# EAGLE design Projet-Elec-Groupe4 (EAGLE 8.0.2)
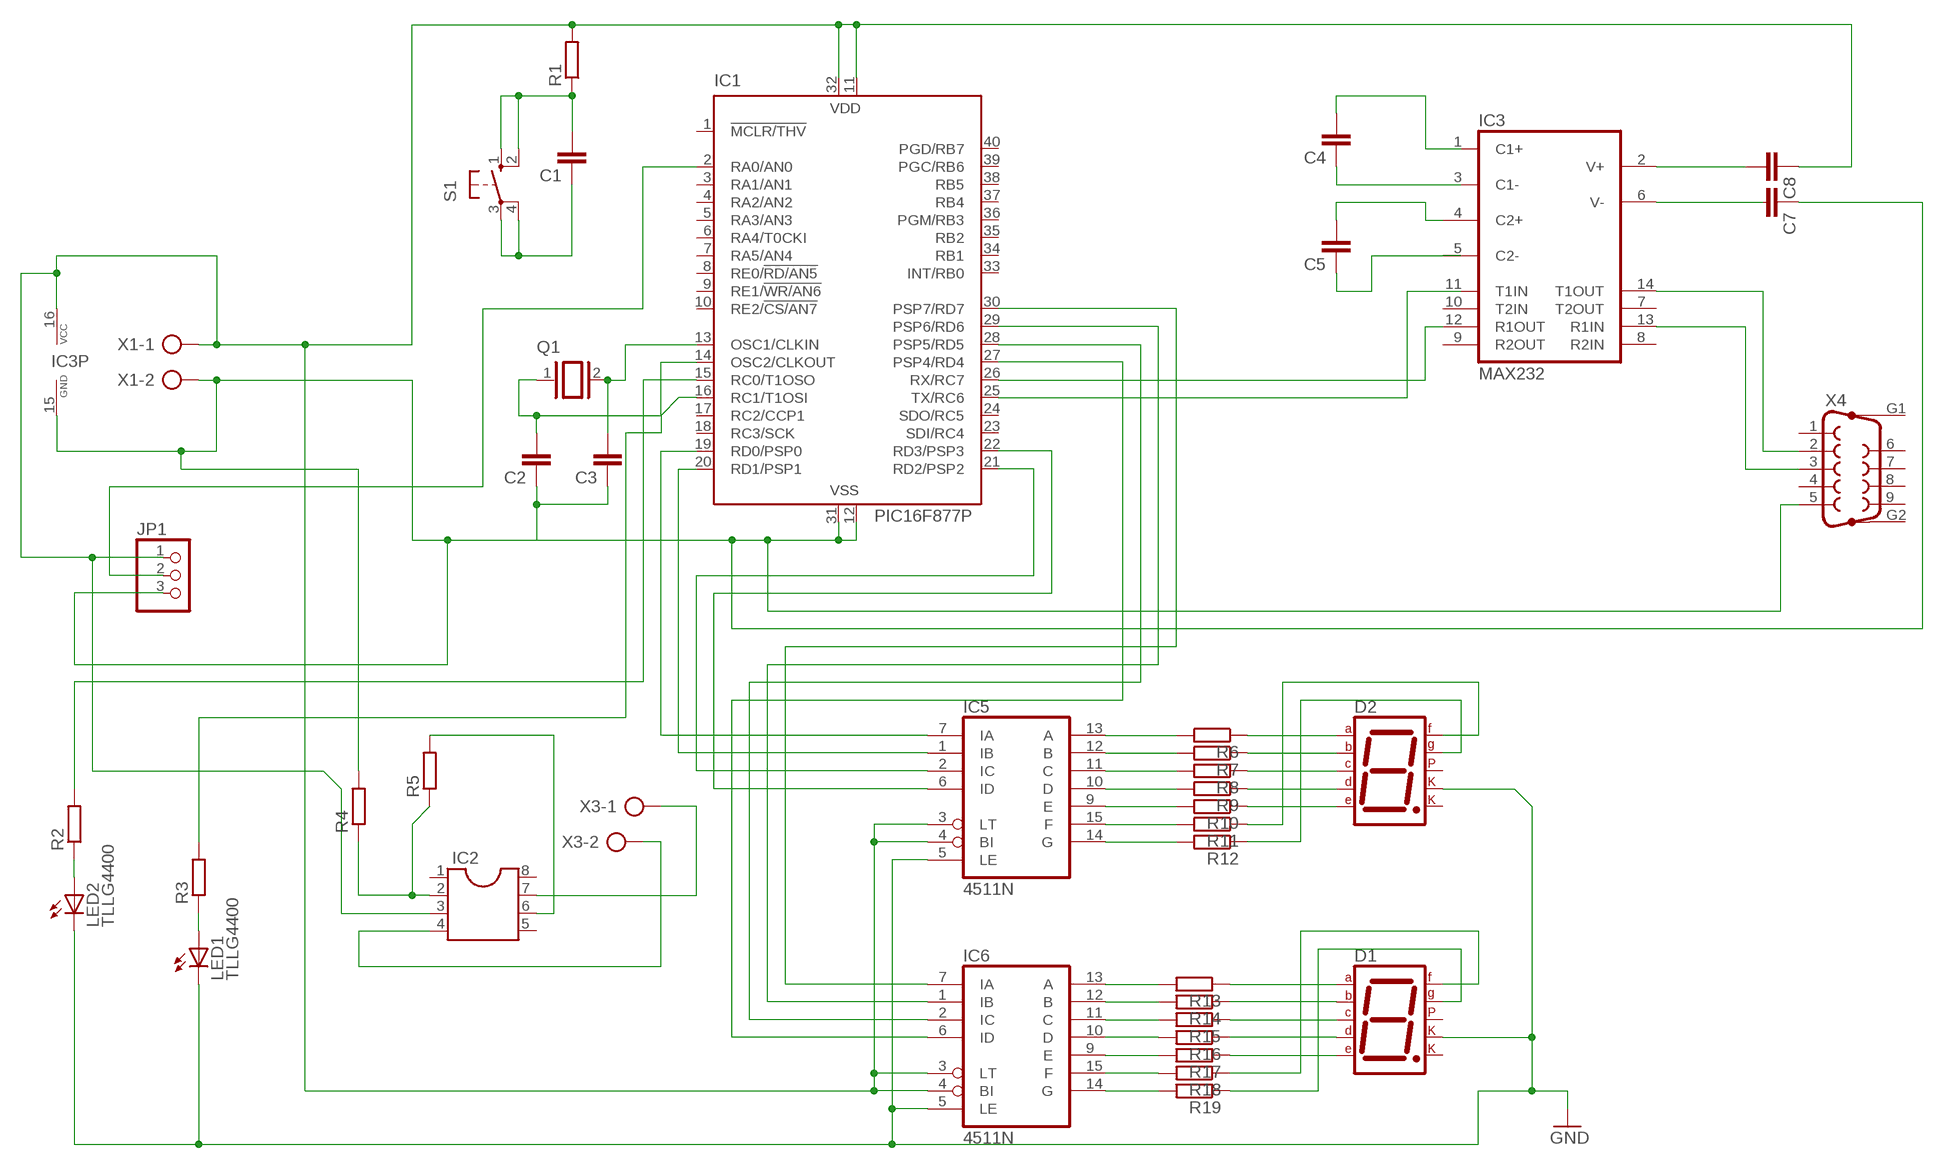
[diagram p0: schematic, sheet 1]

## Parts
C1  C-EU025-025X050  [C025-025X050]
C2  C-EU025-024X044  [C025-024X044]
C3  C-EU025-024X044  [C025-024X044]
C4  C-EU025-024X044  [C025-024X044]
C5  C-EU025-024X044  [C025-024X044]
C7  C-EU025-024X044  [C025-024X044]
C8  C-EU025-024X044  [C025-024X044]
D1  7SEG-CK  [7SEG-13]
D2  7SEG-CK  [7SEG-13]
IC1  PIC16F877P  [DIL40]
IC2  DIL8  [DIL08]
IC3  MAX232  [DIL16]
IC5  4511N  [DIL16]
IC6  4511N  [DIL16]
JP1  PINHD-1X3  [1X03]
LED1  TLLG4400  [LED3MM]
LED2  TLLG4400  [LED3MM]
Q1  XTAL/S  [QS]
R1  R-EU_0207/10  [0207/10]
R2  R-EU_0207/10  [0207/10]
R3  R-EU_0207/10  [0207/10]
R4  R-EU_0207/10  [0207/10]
R5  R-EU_0207/10  [0207/10]
R6  R-EU_0207/10  [0207/10]
R7  R-EU_0207/10  [0207/10]
R8  R-EU_0207/10  [0207/10]
R9  R-EU_0207/10  [0207/10]
R10  R-EU_0207/10  [0207/10]
R11  R-EU_0207/10  [0207/10]
R12  R-EU_0207/10  [0207/10]
R13  R-EU_0207/10  [0207/10]
R14  R-EU_0207/10  [0207/10]
R15  R-EU_0207/10  [0207/10]
R16  R-EU_0207/10  [0207/10]
R17  R-EU_0207/10  [0207/10]
R18  R-EU_0207/10  [0207/10]
R19  R-EU_0207/10  [0207/10]
S1  10-XX  [B3F-10XX]
X1  AK300/2  [AK300/2]
X3  AK300/2  [AK300/2]
X4  F09HP  [F09HP]

## Nets
GND: D1.3(CK1) D2.3(CK1) IC5.5(LE) IC6.5(LE) LED1.K(C) LED2.K(C)
N$1: C5.2 IC3.4(C2+)
N$2: C2.2 IC1.14(OSC2/CLKOUT) Q1.1
N$3: C8.1 IC1.11(VDD) IC1.32(VDD) IC2.3 IC3.16(VCC) IC5.3(LT) IC5.4(BI) IC6.3(LT) IC6.4(BI) JP1.1 R1.2 X1.1
N$4: C1.2 R1.1 S1.1(S) S1.2(S1)
N$5: C1.1 S1.3(P) S1.4(P1)
N$6: C5.1 IC3.5(C2-)
N$7: C3.2 IC1.13(OSC1/CLKIN) Q1.2
N$9: IC1.25(TX/RC6)
N$10: IC1.2(RA0/AN0) JP1.2
N$11: IC1.26(RX/RC7) IC3.12(R1OUT)
N$12: IC3.14(T1OUT) X4.2
N$13: IC3.13(R1IN) X4.3
N$14: C4.1 IC3.3(C1-)
N$15: C4.2
N$16: IC3.6(V-)
N$17: C8.2 IC3.2(V+)
N$18: IC5.13(A) R6.2
N$19: D2.7(A) R6.1
N$20: IC5.12(B) R7.2
N$21: D2.6(B) R7.1
N$22: IC5.11(C) R8.2
N$23: D2.9(F) R11.1
N$24: D2.10(G) R12.1
N$25: IC2.7 X3.1
N$26: IC1.19(RD0/PSP0) IC5.7(IA)
N$27: IC1.20(RD1/PSP1) IC5.1(IB)
N$28: IC1.21(RD2/PSP2) IC5.2(IC)
N$29: IC1.22(RD3/PSP3) IC5.6(ID)
N$30: IC6.13(A) R13.2
N$31: D1.7(A) R13.1
N$32: D1.6(B) R14.1
N$33: IC6.12(B) R14.2
N$34: IC6.11(C) R15.2
N$35: IC1.27(PSP4/RD4) IC6.6(ID)
N$36: IC1.28(PSP5/RD5) IC6.2(IC)
N$37: IC1.29(PSP6/RD6) IC6.1(IB)
N$38: IC1.30(PSP7/RD7) IC6.7(IA)
N$39: IC1.15(RC0/T1OSO) R2.2
N$40: LED2.A R2.1
N$41: IC2.4 X3.2
N$42: IC2.2 R4.1 R5.1
N$44: LED1.A R3.1
N$45: IC2.6 R5.2
N$46: D2.4(C) R8.1
N$47: D1.9(F) R18.1
N$48: D1.10(G) R19.1
N$49: IC5.10(D) R9.2
N$50: D2.2(D) R9.1
N$51: IC5.9(E) R10.2
N$52: D2.1(E) R10.1
N$53: IC5.15(F) R11.2
N$54: IC5.14(G) R12.2
N$55: IC6.10(D) R16.2
N$56: IC6.9(E) R17.2
N$57: IC6.15(F) R18.2
N$58: IC6.14(G) R19.2
N$59: D1.4(C) R15.1
N$60: D1.2(D) R16.1
N$61: D1.1(E) R17.1
N$63: IC1.16(RC1/T1OSI) R3.2
N$65: C2.1 C3.1 C7.1 IC1.12(VSS) IC1.31(VSS) IC3.15(GND) JP1.3 R4.2 X1.2 X4.5
Unconnected: C7.2 D1.5(DP) D1.8(CK2) D2.5(DP) D2.8(CK2) IC1.1(!MCLR/THV) IC1.3(RA1/AN1) IC1.4(RA2/AN2) IC1.5(RA3/AN3) IC1.6(RA4/T0CKI) IC1.7(RA5/AN4) IC1.8(RE0/!RD/AN5) IC1.9(RE1/!WR/AN6) IC1.10(RE2/!CS/AN7) IC1.17(RC2/CCP1) IC1.18(RC3/SCK) IC1.23(SDI/RC4) IC1.24(SDO/RC5) IC1.33(INT/RB0) IC1.34(RB1) IC1.35(RB2) IC1.36(PGM/RB3) IC1.37(RB4) IC1.38(RB5) IC1.39(PGC/RB6) IC1.40(PGD/RB7) IC2.1 IC2.5 IC2.8 IC3.1(C1+) IC3.7(T2OUT) IC3.8(R2IN) IC3.9(R2OUT) IC3.10(T2IN) IC3.11(T1IN) X4.1 X4.4 X4.6 X4.7 X4.8 X4.9 X4.G1 X4.G2

## Power pins joined to a net without a drawn wire
VDD: IC5.16(VDD) IC6.16(VDD)
VSS: IC5.8(VSS) IC6.8(VSS)

## Library data of the parts
C1-C5 C7 C8 = rcl:C-EU: CAPACITOR, European symbol
D1 D2 = special:7SEG-CK: 7-segment DISPLAY single cathode, 13 mm
IC1 = microchip:PIC16F87*: MICROCONTROLLER; MF: MICROCHIP; MPN: PIC16F877-04/P; OC_FARNELL: 9761349; OC_NEWARK: 61K3463
IC2 = ic-package:DIL8: Dual In Line / Socket
IC3 = maxim:MAX232: RS232 TRANSCEIVER; MF: MAXIM; MPN: MAX232ACPE+; OC_FARNELL: 9723773; OC_NEWARK: 68K4544
IC5 IC6 = 45xx:4511: BCD to 7-segment LATCH/DECODER/DRIVER
JP1 = pinhead:PINHD-1X3: PIN HEADER
LED1 LED2 = led:TLLG4400: Low Current (2mA) LED 3 mm Tinted Diffused Package color GREEN Source: Data sheet <http://www.farnell.com/datasheets/391098.pdf>; MF: VISHAY SEMICONDUCTOR; OC_FARNELL: 1612435
Q1 = special:XTAL/S: CRYSTAL
R1-R19 = rcl:R-EU_: RESISTOR, European symbol
S1 = switch-omron:10-XX: OMRON SWITCH; MPN: B3F-1000; OC_FARNELL: 176432; OC_NEWARK: 36M3542
X1 X3 = con-ptr500:AK300/2: CONNECTOR; OC_FARNELL: unknown; OC_NEWARK: unknown
X4 = con-subd:F09HP: SUB-D; OC_FARNELL: unknown; OC_NEWARK: unknown

## Board
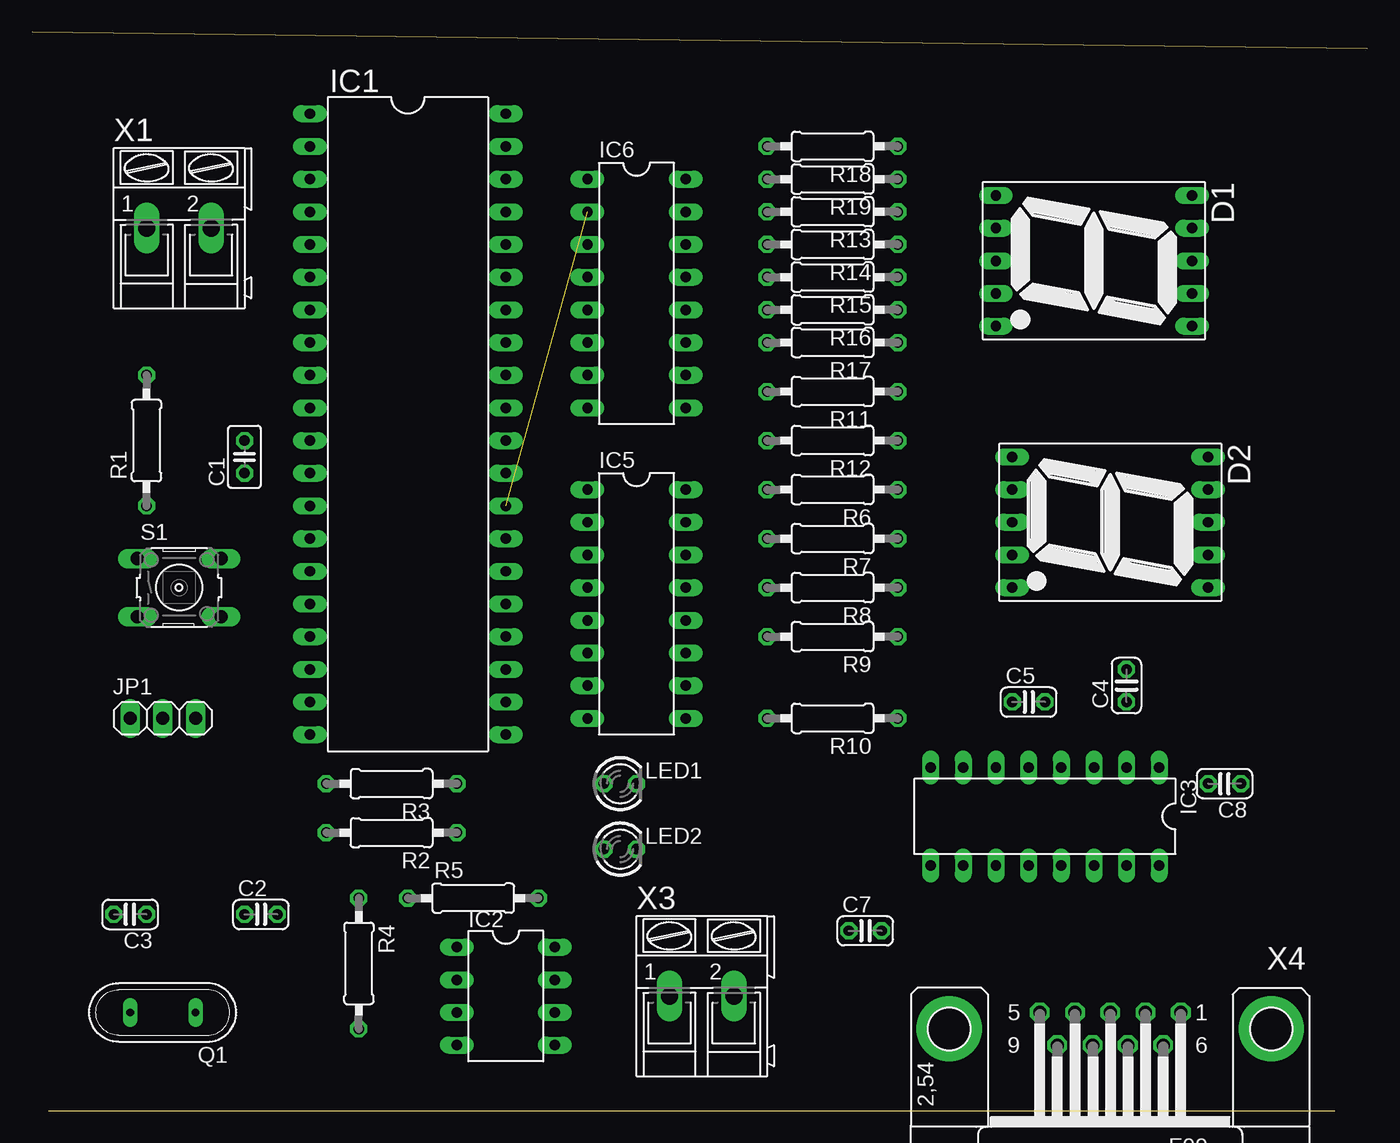
[diagram p1: board, top side]
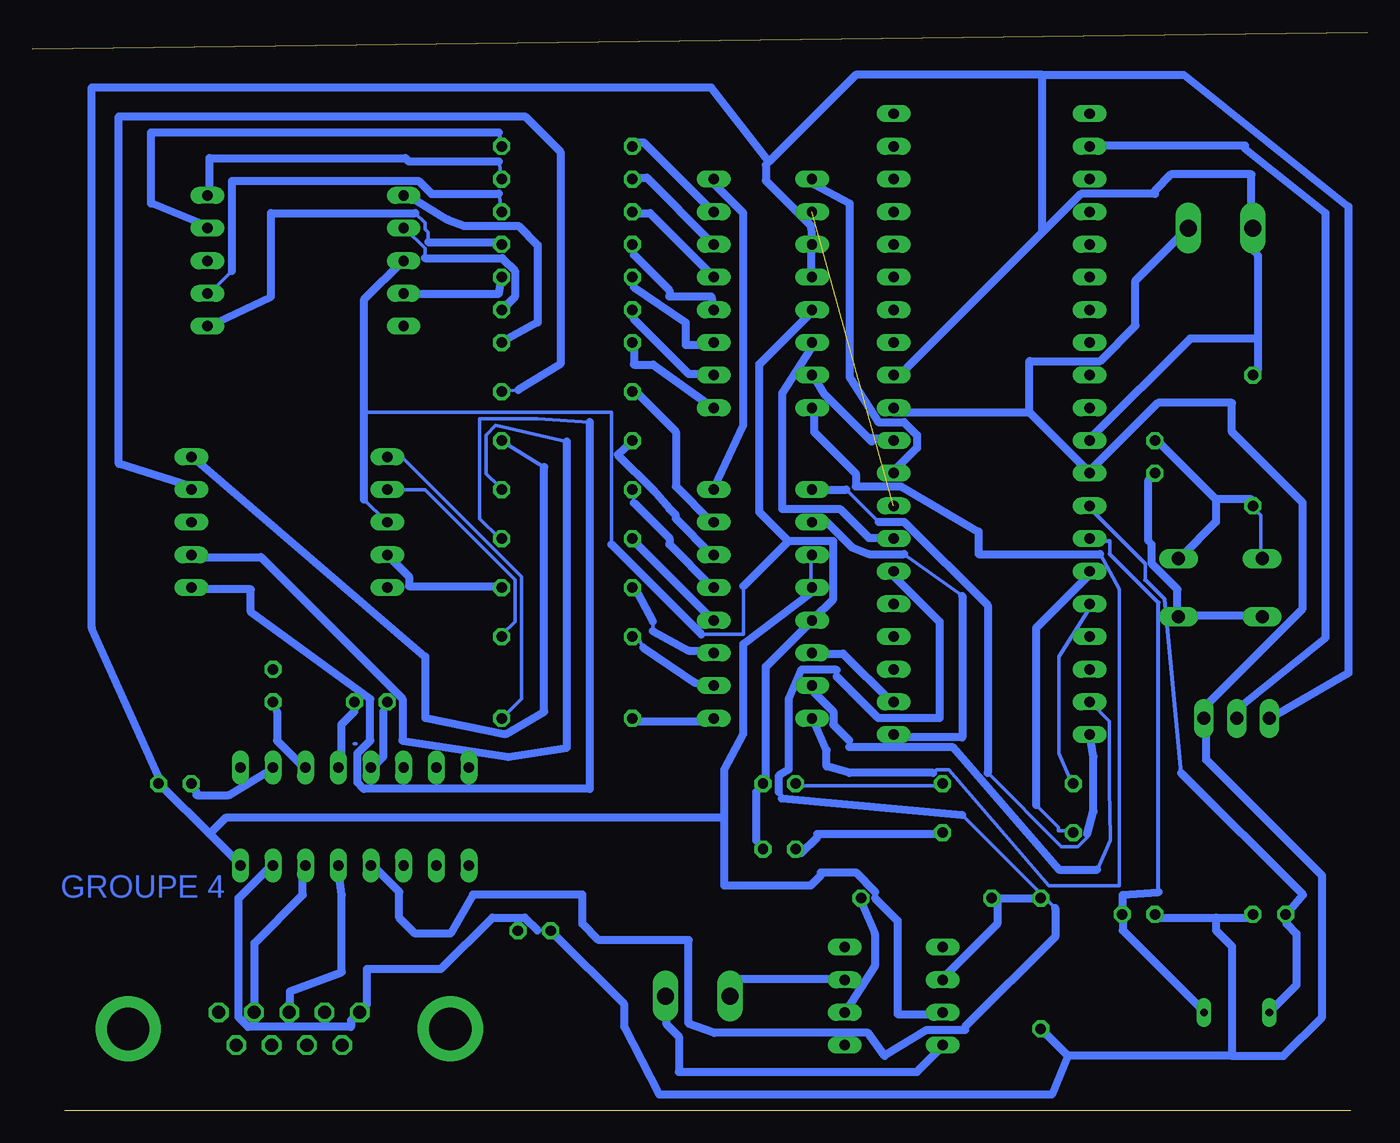
[diagram p2: board, bottom side, seen from below]

Size 103.81 x 83.81 mm. Coordinates in mm from the lower left corner, seen from the top.
Outline: 1.27,0 101.27,0
Outline: 103.81,82.54 0,83.81
Copper layers (1*16): Top 0.035mm / dielectric 1.5mm / Bottom 0.035mm
Design rules "default": minimum track width 10mil, minimum drill 24mil, track to track 8mil, track to pad 8mil, pad to pad 8mil, via to via 8mil, smd to smd 8mil, copper to edge 40mil, drill to drill 8mil, minimum pad ring 10mil, minimum via ring 8mil, stop-mask expansion 4mil, vias tented up to drill 0mil, thermal gap 10mil

### Footprints (pad centres in the part's own frame; a part is rotated, then mirrored left to right if it is on the bottom)
C025-025X050 = drill 0.813 octagon: 1 -1.27,0; 2 1.27,0
C025-024X044 = drill 0.813 octagon: 1 -1.27,0; 2 1.27,0
7SEG-13 = drill 0.813 long: 1 -5.08,-7.62; 2 -2.54,-7.62; 3 0,-7.62; 4 2.54,-7.62; 5 5.08,-7.62; 6 5.08,7.62; 7 2.54,7.62; 8 0,7.62; 9 -2.54,7.62; 10 -5.08,7.62
DIL40 = drill 0.813 long: 1 -24.13,-7.62; 2 -21.59,-7.62; 3 -19.05,-7.62; 4 -16.51,-7.62; 5 -13.97,-7.62; 6 -11.43,-7.62; 7 -8.89,-7.62; 8 -6.35,-7.62; 9 -3.81,-7.62; 10 -1.27,-7.62; 11 1.27,-7.62; 12 3.81,-7.62; 13 6.35,-7.62; 14 8.89,-7.62; 15 11.43,-7.62; 16 13.97,-7.62; 17 16.51,-7.62; 18 19.05,-7.62; 19 21.59,-7.62; 20 24.13,-7.62; 21 24.13,7.62; 22 21.59,7.62; 23 19.05,7.62; 24 16.51,7.62; 25 13.97,7.62; 26 11.43,7.62; 27 8.89,7.62; 28 6.35,7.62; 29 3.81,7.62; 30 1.27,7.62; 31 -1.27,7.62; 32 -3.81,7.62; 33 -6.35,7.62; 34 -8.89,7.62; 35 -11.43,7.62; 36 -13.97,7.62; 37 -16.51,7.62; 38 -19.05,7.62; 39 -21.59,7.62; 40 -24.13,7.62
DIL08 = drill 0.813 long: 1 -3.81,-3.81; 2 -1.27,-3.81; 3 1.27,-3.81; 4 3.81,-3.81; 5 3.81,3.81; 6 1.27,3.81; 7 -1.27,3.81; 8 -3.81,3.81
DIL16 = drill 0.813 long: 1 -8.89,-3.81; 2 -6.35,-3.81; 3 -3.81,-3.81; 4 -1.27,-3.81; 5 1.27,-3.81; 6 3.81,-3.81; 7 6.35,-3.81; 8 8.89,-3.81; 9 8.89,3.81; 10 6.35,3.81; 11 3.81,3.81; 12 1.27,3.81; 13 -1.27,3.81; 14 -3.81,3.81; 15 -6.35,3.81; 16 -8.89,3.81
1X03 = drill 1.016 long: 1 -2.54,0; 2 0,0; 3 2.54,0
LED3MM = drill 0.813 octagon: A -1.27,0; K 1.27,0
QS = drill 0.61 long: 1 -2.54,0; 2 2.54,0
0207/10 = drill 0.813 octagon: 1 -5.08,0; 2 5.08,0
B3F-10XX = drill 1.016 long: 1 -3.251,2.261; 2 3.251,2.261; 3 -3.251,-2.261; 4 3.251,-2.261
AK300/2 = drill 1.321 long: 1 -2.515,0; 2 2.489,0
F09HP = drill 1.016 octagon: 1 -5.486,-1.27; 2 -2.743,-1.27; 3 0,-1.27; 4 2.743,-1.27; 5 5.486,-1.27; 6 -4.115,1.27; 7 -1.372,1.27; 8 1.372,1.27; 9 4.115,1.27 | drill 3.302 pad 5.08: G1 -12.522,0; G2 12.522,0

### Placement (x,y rotation side)
C1  16.51,50.8 90 top
C2  17.78,15.24 0 top
C3  7.62,15.24 180 top
C4  85.09,33.02 90 top
C5  77.47,31.75 0 top
C7  64.77,13.97 0 top
C8  92.71,25.4 180 top
D1  82.55,66.04 270 top
D2  83.82,45.72 270 top
IC1  29.21,53.34 270 top
IC2  36.83,8.89 270 top
IC3  78.74,22.86 180 top
IC5  46.99,39.37 270 top
IC6  46.99,63.5 270 top
JP1  10.16,30.48 0 top
LED1  45.72,25.4 0 top
LED2  45.72,20.32 0 top
Q1  10.16,7.62 180 top
R1  8.89,52.07 90 top
R2  27.94,21.59 180 top
R3  27.94,25.4 180 top
R4  25.4,11.43 270 top
R5  34.29,16.51 0 top
R6  62.23,48.26 180 top
R7  62.23,44.45 180 top
R8  62.23,40.64 180 top
R9  62.23,36.83 180 top
R10  62.23,30.48 180 top
R11  62.23,55.88 180 top
R12  62.23,52.07 180 top
R13  62.23,69.85 180 top
R14  62.23,67.31 180 top
R15  62.23,64.77 180 top
R16  62.23,62.23 180 top
R17  62.23,59.69 180 top
R18  62.23,74.93 180 top
R19  62.23,72.39 180 top
S1  11.43,40.64 0 top
X1  11.43,68.58 0 top
X3  52.07,8.89 0 top
X4  83.82,6.35 180 top

### Tracks (layer width: path | path; a pad name or v marks a point on that pad's centre or on a via)
GND
  Bottom 0.254: 47.52,21 47.02,20.5 LED2.K | 47.52,24.75 47.02,25.25 LED1.K 46.77,25.5 | 43.27,38 IC5.5 43.02,38.25 | 78.02,47.5 76.27,45.75 D2.3 | 75.02,66 D1.3 | 43.27,62 IC6.5 | 78.02,54.25 58.77,54.25 58.77,44 | 51.77,37 48.52,37 48.52,40.75
  Bottom 0.61: 47.52,24.75 47.52,21 | 43.27,38 46.77,34.5 46.77,25.5 | 78.02,47.5 78.02,54.25 78.02,63 75.02,66 | 43.27,62 47.27,58 47.27,46.5 45.02,44.25 | 45.02,44.25 41.52,44.25 41.52,39.75 43.02,38.25 | 51.77,37 58.77,44 | 45.02,44.25 48.52,40.75
N$1
  Bottom 0.254: 78.77,31 78.77,31.75 C5.2 | 79.77,26.75 IC3.4
  Bottom 0.61: 79.77,26.75 79.77,30 78.77,31
N$2
  Bottom 0.254: 12.77,7.75 Q1.1 | 19.02,15 C2.2 19.02,15.25 | 20.02,43.25 20.02,44.25 | 21.52,44.25 IC1.14
  Bottom 0.305: 20.02,44.25 21.52,44.25 | 20.02,43.25 16.25,39.48 16.25,16.98
  Bottom 0.61: 12.77,7.75 19.02,14 19.02,15 | 16.25,16.98 19.02,16.75 19.02,15.25
N$3
  Bottom 0.254: 43.27,65 IC6.4 | 43.27,67.25 IC6.3 | 8.52,57.5 8.77,57.25 R1.2 | 8.77,66.75 8.52,66.5 | 8.77,68.5 X1.1 9.02,68.75 | 21.52,52.25 IC1.11 | 35.77,57.75 35.77,57.25 36.77,57.25 IC1.32 | 16.52,71.5 16.52,71.25 | 7.52,30.5 JP1.1 | 46.52,73.75 46.77,73.5 | 87.77,19.25 IC3.16 | 93.77,25.25 C8.1 94.02,25.5 94.02,26 | 38.27,17 38.27,16.5 | 42.52,18.25 42.52,18.5 | 43.27,40.25 43.27,40.5 IC5.4 43.27,40.75 43.27,43 IC5.3 | 33.02,7.5 IC2.3
  Bottom 0.61: 43.27,67.25 43.27,65 | 8.52,66.5 8.52,60 | 8.52,60 8.52,57.5 | 8.77,68.5 8.77,66.75 | 21.52,52.25 13.77,60 8.52,60 | 25.27,68.25 22.27,71.25 16.52,71.25 | 25.27,68.25 35.77,57.75 | 16.52,71.5 15.27,72.75 9.02,72.75 9.02,68.75 | 7.52,30.5 1.48,34 1.48,70.25 14.27,80.5 25.27,80.5 | 25.27,68.25 25.27,80.5 | 46.77,73.5 46.77,72.27 43.27,68.77 IC6.3 | 25.27,80.5 39.77,80.5 46.52,73.75 51.02,79.52 99.17,79.52 99.17,37.5 94.02,26 | 93.77,25.25 90.02,21.5 | 90.02,21.5 87.77,19.25 | 33.02,7.5 36.52,7.5 36.52,14.75 38.27,16.5 | 38.27,17 39.77,18.5 42.52,18.5 | 42.52,18.25 43.27,17.5 50.02,17.5 50.02,22.75 | 50.02,22.75 50.02,26.5 48.54,29.25 48.54,36.25 43.27,40.25 | 90.02,21.5 88.77,22.75 50.02,22.75
N$4
  Bottom 0.254: S1.1 8.27,43 8.27,46.25 8.77,46.75 R1.1 9.02,47 9.02,47.5 | 16.27,52 C1.2 | 14.52,43 S1.2
  Bottom 0.61: 11.77,47.5 16.27,52 | 9.02,47.5 11.77,47.5 | 14.52,43 11.77,45.75 11.77,47.5
N$5
  Bottom 0.254: 17.02,49 16.52,49.5 C1.1 | 16.77,44 17.02,44.25 | 14.77,38.5 S1.4 14.52,38.5 | 8.27,38.5 S1.3
  Bottom 0.61: 17.02,44.25 17.02,49 | 16.77,44 16.77,42.5 14.77,40.5 14.77,38.5 | 14.52,38.5 8.27,38.5
N$6
  Bottom 0.254: 76.52,31 76.27,31.25 76.27,31.75 C5.1 | 77.27,26.75 IC3.5
  Bottom 0.61: 77.27,26.75 76.52,27.5 76.52,31
N$7
  Bottom 0.254: 7.52,7.75 Q1.2 | 6.27,15 C3.2 6.27,15.25 | 17.27,41.25 17.27,42.5 | 21.52,46.75 IC1.13
  Bottom 0.305: 17.27,42.5 21.52,46.75 | 17.27,41.25 15.75,39.73 14.48,26.23
  Bottom 0.61: 7.52,7.75 5.52,9.75 5.52,13.75 6.27,14.5 6.27,15 | 14.48,26.23 5,16.75 6.27,15.25
N$8
  Bottom 0.254: 78.77,28.5 78.64,28.51
  pour Bottom (isolate 0.8): 0,83.82 0,0 104.14,0 104.14,82.55
N$10
  Bottom 0.254: 9.52,74.75 9.52,75 | 10.02,31.25 10.02,30.5 JP1.2 | 21.52,75 IC1.2
  Bottom 0.61: 9.52,75 21.52,75 | 9.52,74.75 3.25,69.75 3.25,36.75 10.02,31.25
N$11
  Bottom 0.254: 31.27,6.5 31.27,6.25 | 31.52,22.98 24.27,15.73 | 45.52,24.25 45.52,24.5 45.77,24.75 | 41.27,33.75 41.27,34.25 | 36.77,41.5 36.77,41.75 IC1.26 | 77.27,19 IC3.12
  Bottom 0.61: 77.27,19 75.27,17 75.27,15 74.02,13.75 71.29,13.75 69.54,16.77 61.02,16.77 61.02,14.5 59.77,13.25 52.77,13.25 52.77,6.75 50.79,6.04 38.81,6.04 37.54,4.25 34.27,6.25 31.27,6.25 | 31.27,6.5 24.27,13.5 24.27,15.73 | 45.52,24.25 31.52,22.98 | 45.77,24.75 45.77,26 45,26.5 45,32 44.02,34.25 41.27,34.25 | 41.27,33.75 38.02,30.5 33.27,30.5 33.27,38 36.77,41.5
N$12
  Bottom 0.254: 82.77,19 IC3.14 | 86.52,7.75 X4.2
  Bottom 0.61: 82.77,19 82.77,16.75 86.52,13 86.52,7.75
N$13
  Bottom 0.254: 80.02,19 IC3.13 | 83.77,7.75 X4.3
  Bottom 0.61: 80.02,19 79.73,16.75 79.73,10.75 83.77,9.25 83.77,7.75
N$14
  Bottom 0.254: 84.77,31 85.02,31.25 85.02,31.75 C4.1 | 82.77,26.75 IC3.3
  Bottom 0.61: 82.77,26.75 84.77,28.75 84.77,31
N$17
  Bottom 0.254: 91.02,24.75 91.02,24.52 | 91.27,25 91.27,25.25 C8.2 | 85.27,26.5 IC3.2
  Bottom 0.61: 85.27,26.5 88.52,24.52 91.02,24.52 | 91.27,25 91.02,24.75
N$18
  Bottom 0.254: 51.02,40.75 IC5.13 | 57.02,47.23 R6.2
  Bottom 0.61: 51.02,40.75 54.27,44 54.27,44.48 57.02,47.23
N$19
  Bottom 0.254: 62.23,51.98 67.77,53.25 68.52,52.5 68.52,49.5 67.52,48.5 R6.1 | 91.27,43 D2.7
  Bottom 0.61: 62.23,51.98 62.23,28.21 66.77,27.48 75.02,28.75 75.02,32 86.02,43 91.27,43
N$20
  Bottom 0.254: 51.02,38.25 IC5.12 | 57.02,44.25 R7.2
  Bottom 0.61: 57.02,44.25 51.02,38.25
N$21
  Bottom 0.254: 60.46,53.5 64.52,53.75 69.02,53.75 69.02,46 67.52,44.5 R7.1 | 91.27,40.5 D2.6
  Bottom 0.61: 91.27,40.5 86.81,40.5 86.81,38.75 77.52,32 77.52,28.75 78.52,27.75 78.52,25.5 78.02,25 60.46,25 60.46,53.5
N$22
  Bottom 0.254: 55.54,38 55.54,37.25 | 51.02,35.75 IC5.11 | 57.02,40.75 R8.2
  Bottom 0.61: 51.02,35.75 52.77,35.75 55.54,37.25 | 57.02,40.75 55.54,38
N$23
  Bottom 0.254: 66,56 R11.1 | 91.52,48.5 D2.9
  Bottom 0.61: 66,56 62.73,58 62.73,74.5 65.5,77.27 97.08,77.27 97.08,50.25 91.52,48.5
N$24
  Bottom 0.254: 64,50 67.27,52 R12.1 | 91.27,50.75 D2.10
  Bottom 0.61: 64,50 64,31 67.02,29.25 73.25,30.52 73.25,35.27 91.27,50.75
N$25
  Bottom 0.254: 40.77,10.25 IC2.7 | 49.52,9 X3.1
  Bottom 0.61: 40.77,10.25 49.52,10.25 49.52,9
N$26
  Bottom 0.254: 21,18.73 20,21 20,21.25 20.04,25.02 20.04,30.27 21.52,31.75 IC1.19 | 40.27,28.75 40.27,28.27 | 43.02,32.5 43.02,33 IC5.7
  Bottom 0.61: 21,18.73 24,18.73 32.27,28.27 40.27,28.27 | 40.27,28.75 41.52,30 41.52,31 43.02,32.5
N$27
  Bottom 0.254: 21.77,21.5 21.77,21.25 22.52,20.5 23.77,20.5 29.52,26.25 | 40.5,48.25 38,45.75 | 21.52,29 IC1.20 | 43.02,48.25 IC5.1
  Bottom 0.61: 21.52,29 21.29,27.5 21.29,23.25 21.77,21.5 | 29.52,26.25 29.52,39.25 36.02,45.75 38,45.75 | 43.02,48.25 40.5,48.25
N$28
  Bottom 0.254: 36.02,43.25 31.5,40 | 36.77,29 IC1.21 | 43.02,45.75 IC5.2
  Bottom 0.61: 36.77,29 31.5,29 31.5,40 | 36.02,43.25 38.77,43.25 40.04,43.75 42.04,45.75 43.02,45.75
N$29
  Bottom 0.254: 37.02,31.75 IC1.22 | 43.02,35.5 IC5.6
  Bottom 0.61: 37.02,31.75 40.77,35.5 43.02,35.5
N$30
  Bottom 0.254: 51.02,65 IC6.13 | 57.02,69.75 R13.2
  Bottom 0.61: 51.02,65 55.77,69.75 57.02,69.75
N$31
  Bottom 0.254: 72.77,71.25 72.77,71.27 | 88.27,65.25 90.02,63.5 D1.7 | 67.52,71.27 R13.1
  Bottom 0.61: 72.77,71.27 67.52,71.27 | 72.77,71.25 73.77,72.25 88.27,72.25 88.27,65.25
N$32
  Bottom 0.254: 73.02,67.5 73.02,68.25 73.27,68.5 73.27,69 74.02,69.75 | 67.52,67.5 R14.1 | 90.02,61 D1.6
  Bottom 0.61: 73.02,67.5 67.52,67.5 | 74.02,69.75 85.23,69.75 85.23,63.25 90.02,61
N$33
  Bottom 0.254: 57.02,66.5 57.02,67.25 R14.2
  Bottom 0.61: 57.02,66.5 54.27,63.75 54.27,63.27 51.02,63.27 IC6.12
N$34
  Bottom 0.254: 57.02,64 57.02,64.75 R15.2 | 51.02,59.5 IC6.11
  Bottom 0.61: 51.02,59.5 53,59.5 53,61.25 57.02,64
N$35
  Bottom 0.254: 43.27,59.25 43.27,59.5 IC6.6 | 37.02,44.5 IC1.27
  Bottom 0.61: 37.02,44.5 38.77,44.5 41.02,46.75 45.5,46.75 45.5,55.75 43.27,59.25
N$36  (1 unrouted)
N$37
  Bottom 0.254: 43.02,72 43.02,72.25 IC6.1 | 36.77,49.75 IC1.29
  Bottom 0.61: 36.77,49.75 35.02,51.5 35.02,52.5 36.02,53.5 38.02,53.5 40.25,57 40.25,70.5 43.02,72
N$38
  Bottom 0.254: 38.52,51.98 38.52,52.25 | 37.02,52.25 IC1.30 | 43.02,57 IC6.7
  Bottom 0.61: 38.52,52.25 37.02,52.25 | 38.52,51.98 42.27,55.73 43.02,57
N$39
  Bottom 0.254: 25.77,23.75 24.02,22 24.02,21.75 23.02,21.75 R2.2 | 21.77,41.5 21.77,41.75 IC1.15
  Bottom 0.61: 25.77,23.75 25.77,37.5 21.77,41.5
N$40
  Bottom 0.254: 42.77,21.25 42.77,21.5 | 44.02,20 44.27,20 44.27,20.25 LED2.A | 33.02,21.5 R2.1
  Bottom 0.61: 42.77,21.5 33.02,21.5 | 44.02,20 42.77,21.25
N$41
  Bottom 0.254: 33.02,5 IC2.4 | 54.52,8.75 X3.2
  Bottom 0.61: 33.02,5 35.02,3 53.52,3 53.52,5.75 54.52,6.75 54.52,8.75
N$42
  Bottom 0.254: 25.52,16.5 R4.1 | 33.02,10.25 IC2.2 | 29.02,16.5 28.77,16.5 R5.1 29.02,16.5
  Bottom 0.61: 25.52,16.5 28.77,16.5 28.77,14.5 33.02,10.25
N$44
  Bottom 0.254: R3.1 33.02,25.25 44.27,25.25 LED1.A
N$45
  Bottom 0.254: 39.27,16 39.27,16.5 R5.2 | 40.52,7.75 IC2.6
  Bottom 0.61: 40.52,7.75 38.29,11.25 38.29,13.75 39.27,16
N$46
  Bottom 0.254: 67.52,40.75 R8.1
  Bottom 0.61: 67.52,40.75 74.52,40.75 74.52,41.5 D2.4
N$47
  Bottom 0.254: 67.52,76.02 R18.1 | 90.27,68.75 D1.9
  Bottom 0.61: 67.52,76.02 94.56,76.02 94.56,70.5 90.27,68.75
N$48
  Bottom 0.254: 67.52,73.77 R19.1 | 90.02,71.25 D1.10
  Bottom 0.61: 67.52,73.77 74.54,73.77 74.79,74.02 90.02,74.02 90.02,71.25
N$49
  Bottom 0.254: 56.29,35.98 57.02,37.25 57.02,37 R9.2
  Bottom 0.61: 56.29,35.98 52.29,33.25 IC5.10
N$50
  Bottom 0.254: R9.1 67.27,37 66.27,38 66.27,41.25 73.27,48.25 76.02,48.25 D2.2
N$51
  Bottom 0.254: 51.02,30.25 IC5.9 | 57.02,30.25 R10.2
  Bottom 0.61: 57.02,30.25 51.02,30.25
N$52
  Bottom 0.254: R10.1 67.27,30.5 65.77,32 65.77,41.5 75.02,50.75 76.02,50.75 D2.1
N$53
  Bottom 0.254: 51.02,45.75 IC5.15 | 57.02,56 R11.2
  Bottom 0.61: 51.02,45.75 53.77,48.5 53.77,52.75 57.02,56
N$54
  Bottom 0.254: 53.77,46.25 53.77,46 | 51.02,43.25 IC5.14
  Bottom 0.61: 53.77,46 51.02,43.25 | 53.77,46.25 54.27,46.75 55.54,48.23 58.29,50.98 R12.2
N$55
  Bottom 0.254: 57.02,61.5 57.02,62 R16.2 | 51.02,57.25 IC6.10
  Bottom 0.61: 51.02,57.25 52.77,57.25 57.02,61.5
N$56
  Bottom 0.254: 51.02,54.75 IC6.9 | 57.02,59.5 R17.2
  Bottom 0.61: 51.02,54.75 55.52,57.98 57.02,57.98 57.02,59.5
N$57
  Bottom 0.254: 57.02,75.25 57.02,75 R18.2 | 51.02,70 IC6.15
  Bottom 0.61: 51.02,70 56.27,75.25 57.02,75.25
N$58
  Bottom 0.254: 51.02,67.5 IC6.14 | 57.02,72.5 R19.2
  Bottom 0.61: 51.02,67.5 56.02,72.5 57.02,72.5
N$59
  Bottom 0.254: 74.77,63.48 74.77,63.5 D1.4
  Bottom 0.61: 74.77,63.48 67.52,63.48 R15.1
N$60
  Bottom 0.254: 73.27,66.25 73.27,67 74.77,68.5 D1.2 | 67.27,62.25 R16.1
  Bottom 0.61: 67.27,62.25 66.27,63.25 66.27,65.25 67.27,66.25 73.27,66.25
N$61
  Bottom 0.254: 67.27,59.75 R17.1 | 74.77,71.25 D1.1
  Bottom 0.61: 67.27,59.75 64.5,61.25 64.5,67.25 66,68.75 70.23,68.75 71.5,69.25 74.77,71.25
N$63
  Bottom 0.254: R3.2 23.02,25.5 24,27.75 24,35.25 21.77,38.75 21.77,39.25 IC1.16
N$65
  Bottom 0.254: 36.77,54.25 36.77,54.5 IC1.31 | 21.77,49.75 IC1.12 21.52,49.75 | 14.02,68.5 X1.2 | 64.52,14 63.52,14 C7.1 63.27,13.75 | 78.27,7.75 X4.5 | 85.27,19 IC3.15 | 9.02,15 C3.1 | 16.27,15 C2.1 | 25.27,6.25 R4.2 | 12.52,30.25 JP1.3 12.52,30.5 12.52,31.5
  Bottom 0.61: 26.27,54.25 21.77,49.75 | 36.77,54.25 26.27,54.25 | 14.02,68.5 18.02,64.5 18.02,61 20.77,58.25 26.27,58.25 26.27,54.25 | 64.52,14 65.52,15 68.02,15 72.02,11 77.77,11 77.77,8.25 78.27,7.75 | 85.27,19 87.77,16.5 87.77,7.25 87.02,6.5 79.02,6.5 79.02,7 78.52,7.5 X4.5 | 16.27,15 11.77,15 | 11.77,15 9.02,15 | 23.27,4.25 25.27,6.25 | 10.52,4.25 23.27,4.25 | 10.52,4.25 10.52,12.75 11.77,14 11.77,15 | 12.52,30.25 12.52,27.25 3.52,18.25 3.52,7.25 6.52,4.25 10.52,4.25 | 63.27,13.75 57.77,8.25 57.77,6.5 55.04,1.23 24.54,1.23 23.27,4.25 | 21.52,49.75 16.27,55 10.52,55 10.52,52.75 5.02,47.25 5.02,39 12.52,31.5
VDD
  Bottom 0.254: 50.77,72 50.77,72.25 IC6.16 | 50.77,48.5 IC5.16
  Bottom 0.61: 50.77,48.5 48.54,53.27 48.54,69.77 50.77,72
VSS
  Bottom 0.254: 33.77,26.25 33.52,26.5 32.52,26.5 24.77,17.48 19.29,17.48 19.29,40.5 20.77,43.25 | 43.02,30.25 IC5.8 | 43.02,54.5 IC6.8
  Bottom 0.61: 43.02,30.25 42.04,28 42.04,26.75 40.27,26.25 33.77,26.25 | 20.77,43.25 30.23,43.25 30.23,45 36.27,48.5 39.77,48.5 39.77,49.5 43.02,52.75 43.02,54.5

### Text on the board
Bottom: GROUPE 4